# Altium schematic sheet EEPROM.SchDoc: =project_title
size Tabloid; PageSetup: Record=PageOptions|CenterHorizontal=True|CenterVertical=True|PrintScale=0.73|XCorrection=1.00|YCorrection=1.00|PrintKind=0|BorderSize=5000000|LeftOffset=0|BottomOffset=0|Orientation=2|PaperLength=1000|PaperWidth=1000|Scale=100|PaperSource=7|PrintQuality=-4|MediaType=1|DitherType=10|PaperKind=A4|PrintScaleMode=1; CompanyName: Luxonis Holding; Organization: Luxonis Holding; Address1: 1925 Harmony Park Drive; Address2: Westminster, CO; Address3: 80234; Address4: United States; SheetNumber: 7; SheetTotal: 14
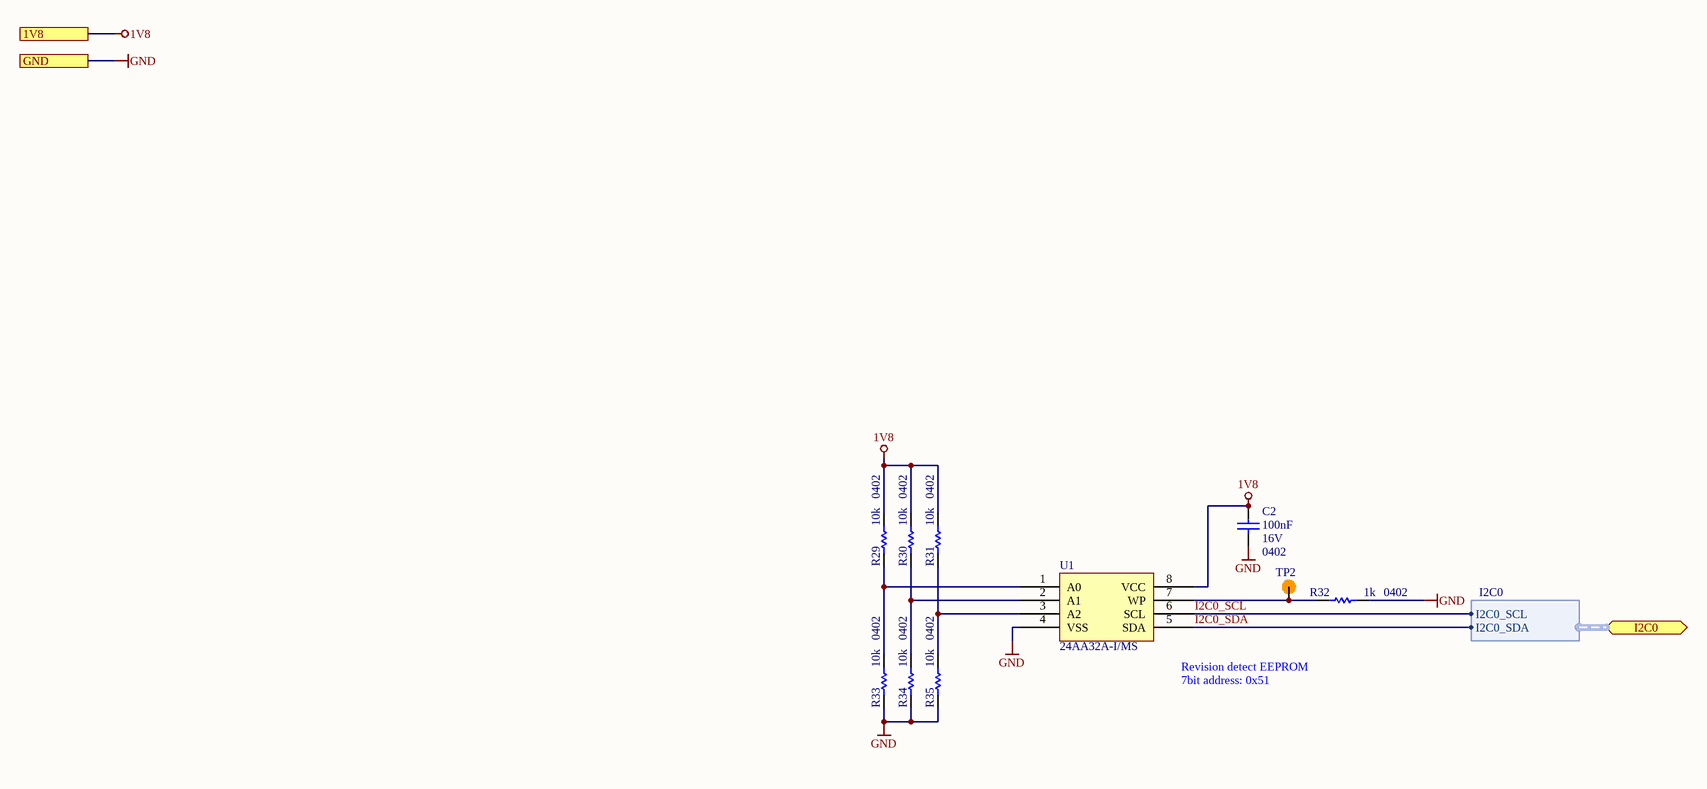
[diagram p0: EEPROM.SchDoc]

## Parts
C2  value 100nF  Voltage Rating: 16V  Case/Package: 0402  [CAPC0402(1005)60_L]  (hidden comment: CL05B104KO5NFNC)
R29  value 10k  Case/Package: 0402  [RESC0402(1005)_L]  (hidden comment: RC0402FR-1310KL)
R30  value 10k  Case/Package: 0402  [RESC0402(1005)_L]  (hidden comment: RC0402FR-1310KL)
R31  value 10k  Case/Package: 0402  [RESC0402(1005)_L]  (hidden comment: RC0402FR-1310KL)
R32  value 1k  Case/Package: 0402  [RESC0402(1005)_L]  (hidden comment: RC0402FR-071KL)
R33  value 10k  Case/Package: 0402  [RESC0402(1005)_L]  (hidden comment: RC0402FR-1310KL)
R34  value 10k  Case/Package: 0402  [RESC0402(1005)_L]  (hidden comment: RC0402FR-1310KL)
R35  value 10k  Case/Package: 0402  [RESC0402(1005)_L]  (hidden comment: RC0402FR-1310KL)
TP2  TEST_POINT  [TP075_150_NS]  (value not drawn)  (no BOM)
U1  24AA32A-I/MS  [24AA32A-I/MS]

## Ports
1V8, GND, I2C0 (bidir, harness I2C0)

## Harnesses
I2C0: I2C0_SCL, I2C0_SDA

## Nets
1V8: C2.2 R29.2 R30.2 R31.2 U1.8(VCC) ; port 1V8
GND: C2.1 R32.1 R33.1 R34.1 R35.1 U1.4(VSS) ; port GND
I2C0_SCL: U1.6(SCL) ; port I2C0.I2C0_SCL
I2C0_SDA: U1.5(SDA) ; port I2C0.I2C0_SDA
NetR29_1: R29.1 R33.2 U1.1(A0)
NetR30_1: R30.1 R34.2 U1.2(A1)
NetR31_1: R31.1 R35.2 U1.3(A2)
NetR32_2: R32.2 TP2.1 U1.7(WP)

## Notes on the sheet
- (near U1) Revision detect EEPROM
- (near U1) 7bit address: 0x51
- Title
- Size:
- Date:
- Tabloid
- Number:
- Time:
- Revision:
- Sheet
- of
- Drawn by:

## Library data of the parts
C2 = CMP-108-000002-6: CAP CER 0.1UF 16V X7R 0402 10%; Manufacturer 1: Samsung; ComponentLink1URL: https://datasheet.ciiva.com/25767/cl05b104ko5nfnc-25767124.pdf?src-supplier=Digi-Key; Length: 1mm; Design Item ID: CL05B104KO5NFNC; Tolerance: 10%; Min Operating Temperature: -55°C; Width: 0.02inch; Dielectric: X7R; ComponentLink1Description: https://datasheet.ciiva.com/25767/cl05b104ko5nfnc-25767124.pdf?src-supplier=Digi-Key; Height: 0.5mm; Depth: 0.5mm; Manufacturer Part Number 1: CL05B104KO5NFNC; Max Operating Temperature: 125°C; Mounting Technology: SMT
R29-R31 R33-R35 = CMP-115-000004-8: RES SMD 10K OHM 1% 1/16W 0402; Manufacturer 1: Yageo; Power Rating: 62.5mW; Voltage Rating: 50V; Temperature Coefficient: 100ppm/°C; Tolerance: 1%; Manufacturer Part Number 1: RC0402FR-1310KL; Max Operating Temperature: 155°C; Min Operating Temperature: -55°C; Design Item ID: RC0402FR-1310KL
R32 = CMP-013-000004-10: RES SMD 1K OHM 1% 1/16W 0402; Manufacturer 1: Yageo; Power Rating: 62.5mW; Voltage Rating: 50V; Min Operating Temperature: -55°C; Design Item ID: RC0402FR-071KL; Tolerance: 1%; Max Operating Temperature: 155°C; Manufacturer Part Number 1: RC0402FR-071KL
TP2 = CMP-015-000000-5: Manufacturer Part Number 1: /; Design Item ID: TEST_POINT; Source: LuxonisMaster.SchLib
U1 = CMP-010-000010-2: IC EEPROM 32K I2C 400KHZ 8MSOP Memory IC 32Kb (4K x 8) I²C 400kHz 900ns 8-MSOP; Manufacturer 1: Microchip; Case/Package: MSOP; Frequency: 400kHz; Memory Size: 32Kb; Manufacturer Part Number 1: 24AA32A-I/MS; Pins: 8